# Altium schematic sheet Power.SchDoc
size A4; SheetNumber: 2; SheetTotal: 4
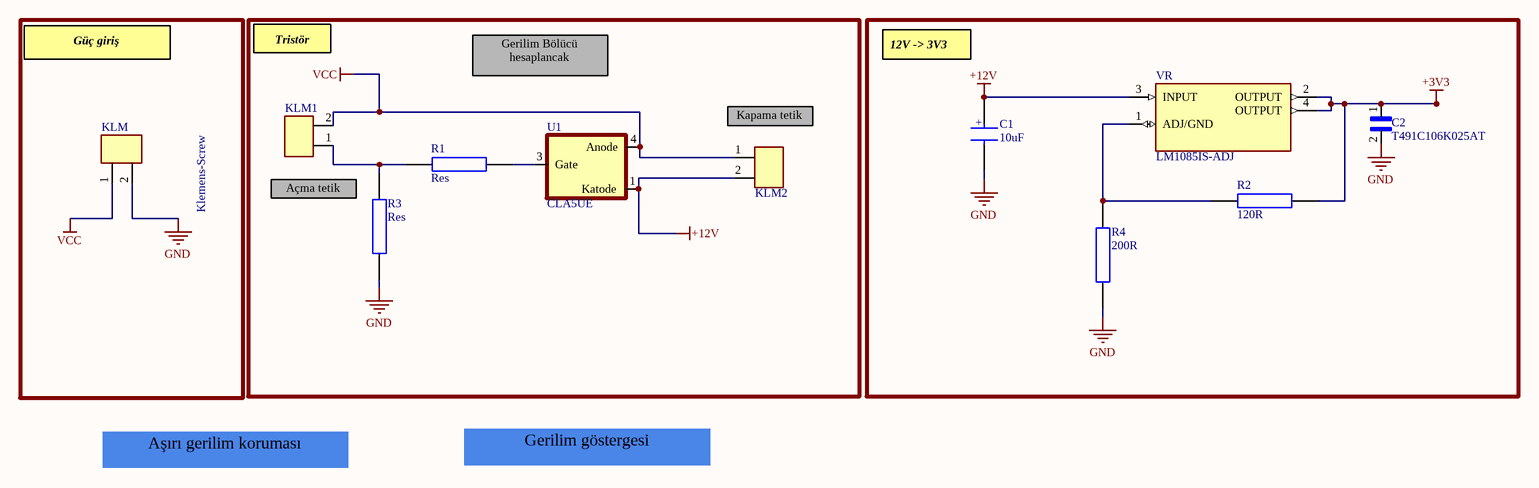
[diagram p0: Power.SchDoc]

## Parts
C1  10uF  [CAP_805]
C2  T491C106K025AT  [CAPPC6032X280N]
KLM  Klemens-Screw  [Klemens-ScrewMount]
KLM1  Klemens-Screw  [Klemens-ScrewMount]  (value not drawn)
KLM2  Klemens-Screw  [Klemens-ScrewMount]  (value not drawn)
R1  Res  [RES_1206]
R2  120R  [RES_1206]
R3  Res  [RES_1206]
R4  200R  [RES_1206]
U1  CLA5UE  [DPAK229P990X239-4N]
VR  LM1085IS-ADJ  [TO254P1524X483-4N]

## Nets
+3V3: C2.1 R2.1 VR.2(OUTPUT) VR.4(OUTPUT)
+12V: C1.1 KLM2.2 U1.1(Katode) VR.3(INPUT)
GND: C1.2 C2.2 KLM.2 R3.1 R4.1
VCC: KLM.1 KLM1.2 KLM2.1 U1.4(Anode)
NetKLM1_1: KLM1.1 R1.2 R3.2
NetR1_1: R1.1 U1.3(Gate)
NetR2_2: R2.2 R4.2 VR.1(ADJ/GND)

## Notes on the sheet
- Güç giriş
- Tristör
- Gerilim Bölücü hesaplancak
- 12V -> 3V3
- (near KLM2) Kapama tetik
- Açma tetik
- Aşırı gerilim koruması
- Gerilim göstergesi
- (in symbol CAP 1uF) +

## Library data of the parts
C1 = CAP 1uF: 0805 smd
C2 = T491C106K025AT: 10 ÂµF Molded Tantalum Capacitors 25 V 2312 (6032 Metric) 1.5Ohm; MF: KEMET; Value: *; SnapEDA_Link: https://www.snapeda.com/parts/T491C106K025AT/KEMET/view-part/?ref=snap; Purchase-URL: https://pricing.snapeda.com/search/part/T491C106K025AT/?ref=eda; Availability: In Stock; Price: None; Package: SMD-2 KEMET; Check_prices: https://www.snapeda.com/parts/T491C106K025AT/KEMET/view-part/?ref=eda; MP: T491C106K025AT
R1-R4 = RES 1K 1206
VR = LM1085IS-ADJ: 3-A, 29-V, linear voltage regulator 3-DDPAK/TO-263; MF: Texas Instruments; SnapEDA_Link: https://www.snapeda.com/parts/LM1085IS-ADJ/Texas%20Instruments/view-part/213969/?ref=snap; Price: None; MP: LM1085IS-ADJ; Availability: Unavailable; Mouser-Purchase-URL: https://snapeda.com/shop?store=Mouser&id=213969; Value: *; Arrow_Electronics-Purchase-URL: https://snapeda.com/shop?store=Arrow+Electronics&id=213969; DigiKey-Purchase-URL: https://snapeda.com/shop?store=DigiKey&id=213969; Package: TO-263-3 Texas Instruments
KLM KLM1 KLM2 = Klemens-Screw: ComponentLink1Description: New link; ComponentLink1URL: *